# Altium schematic sheet Sheet2.SchDoc: Х
size 420 x 297 mm; ApprovedBy: Х; CheckedBy: Х; Author: Х; CompanyName: Х; DrawnBy: Х; Engineer: Х; Organization: Х; Address1: Х; Address2: Х; Address3: Х; Address4: Х; DocumentNumber: Х; Revision: Х; SheetNumber: 2; SheetTotal: 2; 1_Обозначение_документа: ПКГН.468157.001Э3; 2_Наименование_изделия: Изделие; 3_Наименование_документа_1: Схема электрическая; 4_Наименование_документа_2: принципиальная; 5_Разраб.: Саченков В.; 11_Организация: АО "Завод ПРОТОН"; 14_Масштаб: 1:1; 15_Лист: 2; 16_Листов: 1; ImagePath: Х; Application_BuildNumber: Х
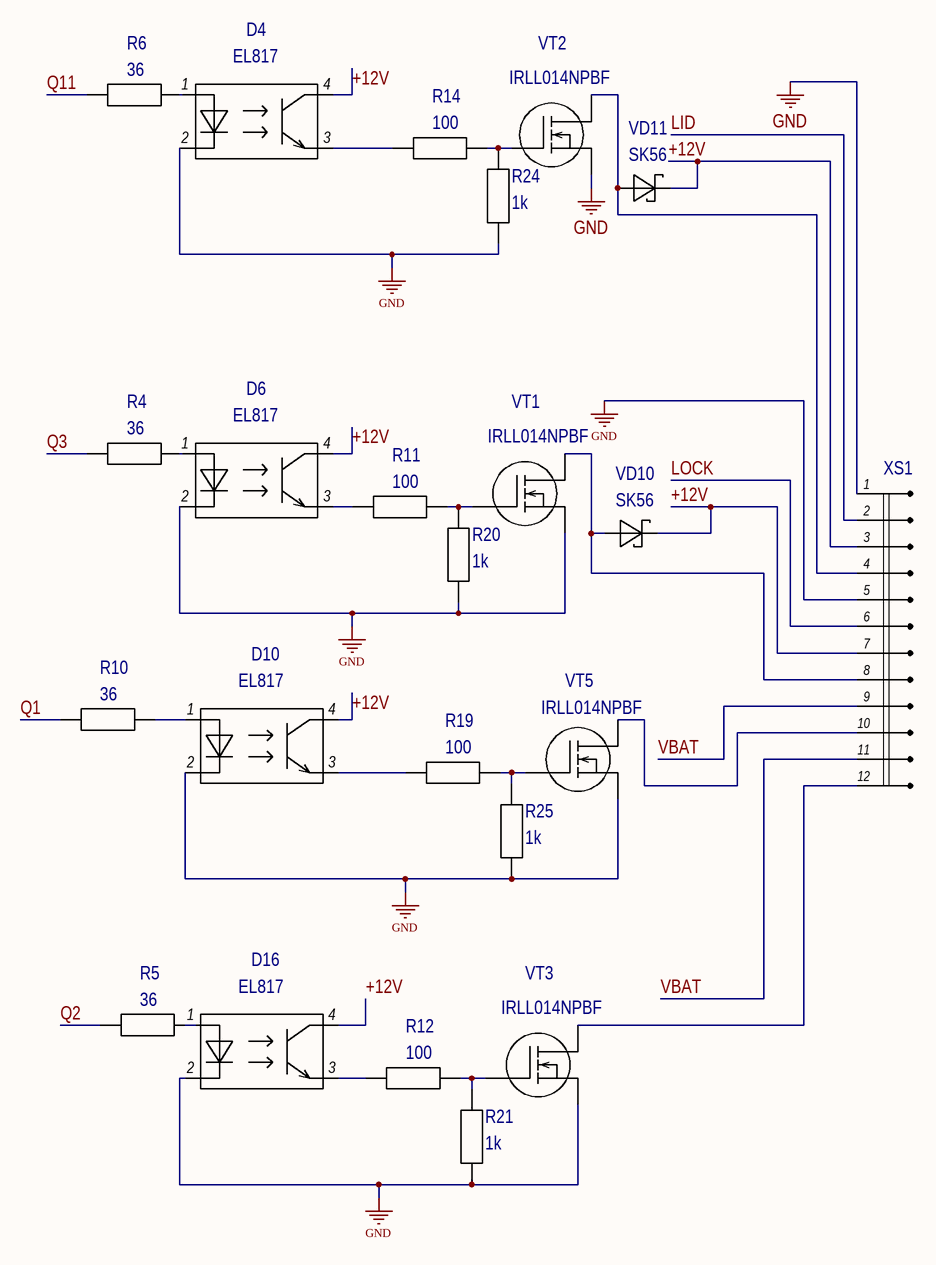
[diagram p0: Sheet2.SchDoc]

## Parts
D4  EL817  [SOP254P1030X390-4N]
D6  EL817  [SOP254P1030X390-4N]
D10  EL817  [SOP254P1030X390-4N]
D16  EL817  [SOP254P1030X390-4N]
R4  36  [R_0603_(1608)]
R5  36  [R_0603_(1608)]
R6  36  [R_0603_(1608)]
R10  36  [R_0603_(1608)]
R11  100  [R_0603_(1608)]
R12  100  [R_0603_(1608)]
R14  100  [R_0603_(1608)]
R19  100  [R_0603_(1608)]
R20  1k  [R_0603_(1608)]
R21  1k  [R_0603_(1608)]
R24  1k  [R_0603_(1608)]
R25  1k  [R_0603_(1608)]
VD10  SK56  [DIONM5236X261N]
VD11  SK56  [DIONM5236X261N]
VT1  IRLL014NPBF  [SOT-223(BCE)]
VT2  IRLL014NPBF  [SOT-223(BCE)]
VT3  IRLL014NPBF  [SOT-223(BCE)]
VT5  IRLL014NPBF  [SOT-223(BCE)]
XS1  Pad 1x12  [PLS-12(NO_3D)]  (value not drawn)

## Nets
GND: D4.2 D6.2 D10.2 D16.2 R20.2 R21.2 R24.2 R25.2 VT1.3(S) VT2.3(S) VT3.3(S) VT5.3(S) XS1.1 XS1.5
+12V: D4.4 D6.4 D10.4 D16.4 VD10.1 VD11.1 XS1.3 XS1.7
LID: XS1.2
LOCK: XS1.6
Q1: R10.2
Q2: R5.2
Q3: R4.2
Q11: R6.2
VBAT: XS1.9 XS1.11
NetD4_1: D4.1 R6.1
NetD4_3: D4.3 R14.1
NetD6_1: D6.1 R4.1
NetD6_3: D6.3 R11.1
NetD10_1: D10.1 R10.1
NetD10_3: D10.3 R19.1
NetD16_1: D16.1 R5.1
NetD16_3: D16.3 R12.1
NetR11_2: R11.2 R20.1 VT1.1(G)
NetR12_2: R12.2 R21.1 VT3.1(G)
NetR14_2: R14.2 R24.1 VT2.1(G)
NetR19_2: R19.2 R25.1 VT5.1(G)
NetVD10_2: VD10.2 VT1.2(D) XS1.8
NetVD11_2: VD11.2 VT2.2(D) XS1.4
NetVT3_2: VT3.2(D) XS1.12
NetVT5_2: VT5.2(D) XS1.10

## Notes on the sheet
- Подп. и дата
- Инв. № дубл.
- Взам. инв. №
- Инв. № подл.
- Изм.
- Лист
- № докум.
- Подп.
- Дата
- Копировал
- Формат А3

## Library data of the parts
D4 D6 D10 D16 = OPTRONE_NPN: Type: Оптопара транзисторная; Package: [SOP-4]
R4-R6 R10-R12 R14 R19-R21 R24 R25 = R: Power dissipation: 0.1 Вт; smd size: 0603; tolerance: 5%; Type: Керамич. чип-резистор
  R11 R12 R14 R19-R21 R24 R25: U max: *
VD10 VD11 = Schottky: https://www.chipdip.ru/product/sk56; Type: Диод Шоттки; U max: 5 А, 60 В; Package: [SMB]
VT1-VT3 VT5 = IRLL014NPBF: Type: Тр-р полевой N-канал.; U max: 55 В; Power dissipation: 2.1 Вт; Package: [SOT-223]